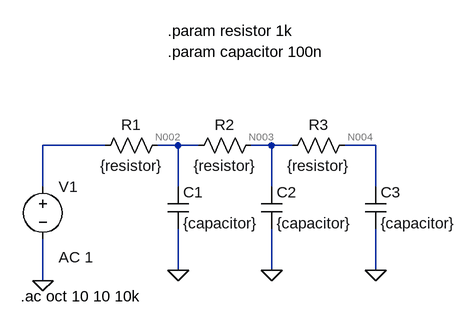
[diagram p0: schematic Draft ep3.asc]
Draft ep3.asc, the LTspice schematic file:
Version 4
SHEET 1 880 680
WIRE 16 32 -80 32
WIRE 128 32 96 32
WIRE 160 32 128 32
WIRE 272 32 240 32
WIRE 304 32 272 32
WIRE 432 32 384 32
WIRE -80 96 -80 32
WIRE 128 96 128 32
WIRE 272 96 272 32
WIRE 432 96 432 32
WIRE 128 224 128 160
WIRE 272 224 272 160
WIRE 432 224 432 160
WIRE -80 240 -80 176
FLAG 128 224 0
FLAG 272 224 0
FLAG 432 224 0
FLAG -80 240 0
SYMBOL voltage -80 80 R0
WINDOW 123 24 124 Left 2
WINDOW 39 0 0 Left 0
SYMATTR InstName V1
SYMATTR Value ""
SYMATTR Value2 AC 1
SYMBOL res 112 16 R90
WINDOW 0 0 56 VBottom 2
WINDOW 3 32 56 VTop 2
SYMATTR InstName R1
SYMATTR Value {resistor}
SYMBOL res 256 16 R90
WINDOW 0 0 56 VBottom 2
WINDOW 3 32 56 VTop 2
SYMATTR InstName R2
SYMATTR Value {resistor}
SYMBOL res 400 16 R90
WINDOW 0 0 56 VBottom 2
WINDOW 3 32 56 VTop 2
SYMATTR InstName R3
SYMATTR Value {resistor}
SYMBOL cap 112 96 R0
SYMATTR InstName C1
SYMATTR Value {capacitor}
SYMBOL cap 256 96 R0
SYMATTR InstName C2
SYMATTR Value {capacitor}
SYMBOL cap 416 96 R0
SYMATTR InstName C3
SYMATTR Value {capacitor}
TEXT 112 -144 Left 2 !.param resistor 1k
TEXT 112 -112 Left 2 !.param capacitor 100n
TEXT -114 264 Left 2 !.ac oct 10 10 10k

The netlist it stands for:
* Draft ep3.asc
V1 N001 0 AC 1
R1 N002 N001 {resistor}
R2 N003 N002 {resistor}
R3 N004 N003 {resistor}
C1 N002 0 {capacitor}
C2 N003 0 {capacitor}
C3 N004 0 {capacitor}
.param resistor 1k
.param capacitor 100n
.ac oct 10 10 10k
.backanno
.end

* Results of the author's LTspice run, read from the files saved beside the schematic
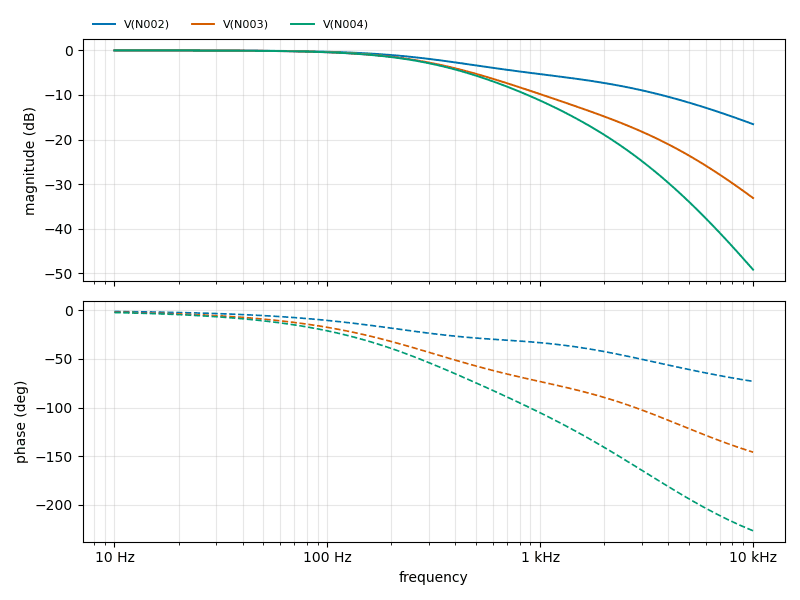
[diagram p1: AC Analysis of Draft ep3.asc, plotted from the saved traces]
* AC Analysis, 1 run:
*   V(N002): -0.00 dB at 10 Hz, -16.54 dB at 10 kHz, peak -0.00 dB at 10 Hz, 3 dB below the peak at 444.2 Hz
*   V(N003): -0.00 dB at 10 Hz, -33.11 dB at 10 kHz, peak -0.00 dB at 10 Hz, 3 dB below the peak at 321.6 Hz
*   V(N004): -0.00 dB at 10 Hz, -49.18 dB at 10 kHz, peak -0.00 dB at 10 Hz, 3 dB below the peak at 309.3 Hz